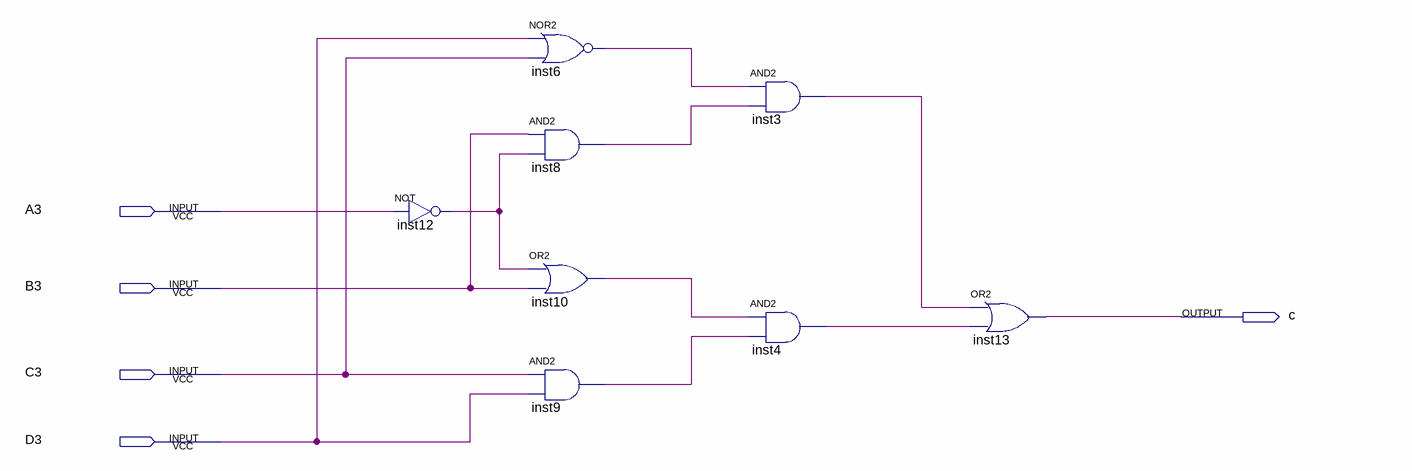
[diagram p0: schematic sheet]
// Quartus schematic Segment_c.bdf as structural Verilog: 8 symbols, 5 pins
module Segment_c (
  input  A3,
  input  B3,
  input  C3,
  input  D3,
  output c
);

  wire inst3_out, inst4_out, inst6_out, inst8_out, inst9_out, inst10_out, inst12_out;

  not inst12 (inst12_out, A3);
  nor inst6 (inst6_out, D3, C3);
  and inst8 (inst8_out, B3, inst12_out);
  or inst10 (inst10_out, inst12_out, B3);
  and inst9 (inst9_out, C3, D3);
  and inst3 (inst3_out, inst6_out, inst8_out);
  and inst4 (inst4_out, inst10_out, inst9_out);
  or inst13 (c, inst3_out, inst4_out);
endmodule
